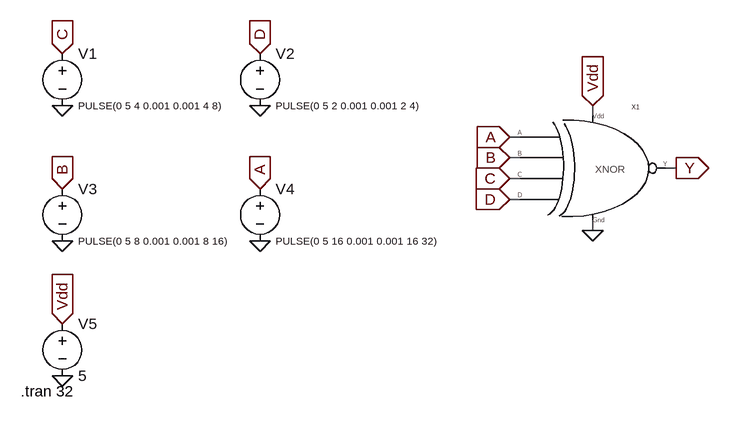
[diagram p0: schematic 4xnor symbol.asc]
4xnor symbol.asc, the LTspice schematic file:
Version 4
SHEET 1 908 680
WIRE 704 32 704 16
WIRE 592 64 576 64
WIRE 592 96 576 96
WIRE 832 112 816 112
WIRE 592 128 576 128
WIRE 592 160 576 160
WIRE 704 208 704 192
FLAG -112 352 Vdd
IOPIN -112 352 In
FLAG 192 -64 D
IOPIN 192 -64 In
FLAG -112 -64 C
IOPIN -112 -64 In
FLAG -112 144 B
IOPIN -112 144 In
FLAG -112 432 0
FLAG 192 224 0
FLAG -112 224 0
FLAG -112 16 0
FLAG 192 16 0
FLAG 192 144 A
IOPIN 192 144 In
FLAG 576 64 A
IOPIN 576 64 In
FLAG 576 96 B
IOPIN 576 96 In
FLAG 576 128 C
IOPIN 576 128 In
FLAG 576 160 D
IOPIN 576 160 In
FLAG 704 16 Vdd
IOPIN 704 16 In
FLAG 704 208 0
FLAG 832 112 Y
IOPIN 832 112 Out
SYMBOL voltage -112 -80 R0
WINDOW 3 24 96 Left 1
WINDOW 123 0 0 Left 0
WINDOW 39 0 0 Left 0
SYMATTR Value PULSE(0 5 4 0.001 0.001 4 8)
SYMATTR InstName V1
SYMBOL voltage 192 -80 R0
WINDOW 3 24 96 Left 1
WINDOW 123 0 0 Left 0
WINDOW 39 0 0 Left 0
SYMATTR Value PULSE(0 5 2 0.001 0.001 2 4)
SYMATTR InstName V2
SYMBOL voltage -112 128 R0
WINDOW 3 24 96 Left 1
WINDOW 123 0 0 Left 0
WINDOW 39 0 0 Left 0
SYMATTR Value PULSE(0 5 8 0.001 0.001 8 16)
SYMATTR InstName V3
SYMBOL voltage 192 128 R0
WINDOW 3 24 96 Left 1
WINDOW 123 0 0 Left 0
WINDOW 39 0 0 Left 0
SYMATTR Value PULSE(0 5 16 0.001 0.001 16 32)
SYMATTR InstName V4
SYMBOL voltage -112 336 R0
WINDOW 123 0 0 Left 0
WINDOW 39 0 0 Left 0
SYMATTR InstName V5
SYMATTR Value 5
SYMBOL 4xnor 608 96 R0
SYMATTR InstName X1
TEXT -176 456 Left 2 !.tran 32

The netlist it stands for:
* 4xnor symbol.asc
V1 C 0 PULSE(0 5 4 0.001 0.001 4 8)
V2 D 0 PULSE(0 5 2 0.001 0.001 2 4)
V3 B 0 PULSE(0 5 8 0.001 0.001 8 16)
V4 A 0 PULSE(0 5 16 0.001 0.001 16 32)
V5 Vdd 0 5
XX1 Vdd 0 Y A B C D 4xnor  ; pins Vdd Gnd Y A B C D
.tran 32
.backanno
.end

* Results of the author's LTspice run, read from the files saved beside the schematic
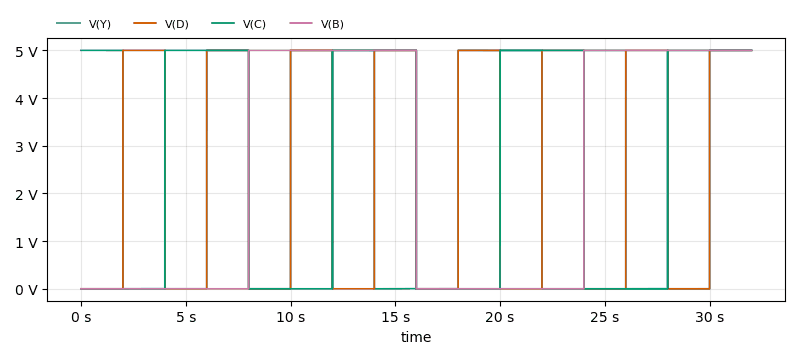
[diagram p1: Transient Analysis of 4xnor symbol.asc, plotted from the saved traces]
* Transient Analysis, 1 run:
*   V(Y): min 0 V, max 5 V, average 2.5 V, rms 3.536 V, last 5 V
*   V(D): min 0 V, max 5 V, average 2.501 V, rms 3.536 V, last 5 V
*   V(C): min 0 V, max 5 V, average 2.5 V, rms 3.536 V, last 5 V
*   V(B): min 0 V, max 5 V, average 2.5 V, rms 3.536 V, last 5 V